# Altium schematic sheet Matrix.SchDoc
size A3; DrawnBy: JimBobJones; DocumentNumber: 2; SheetNumber: 2; SheetTotal: 4
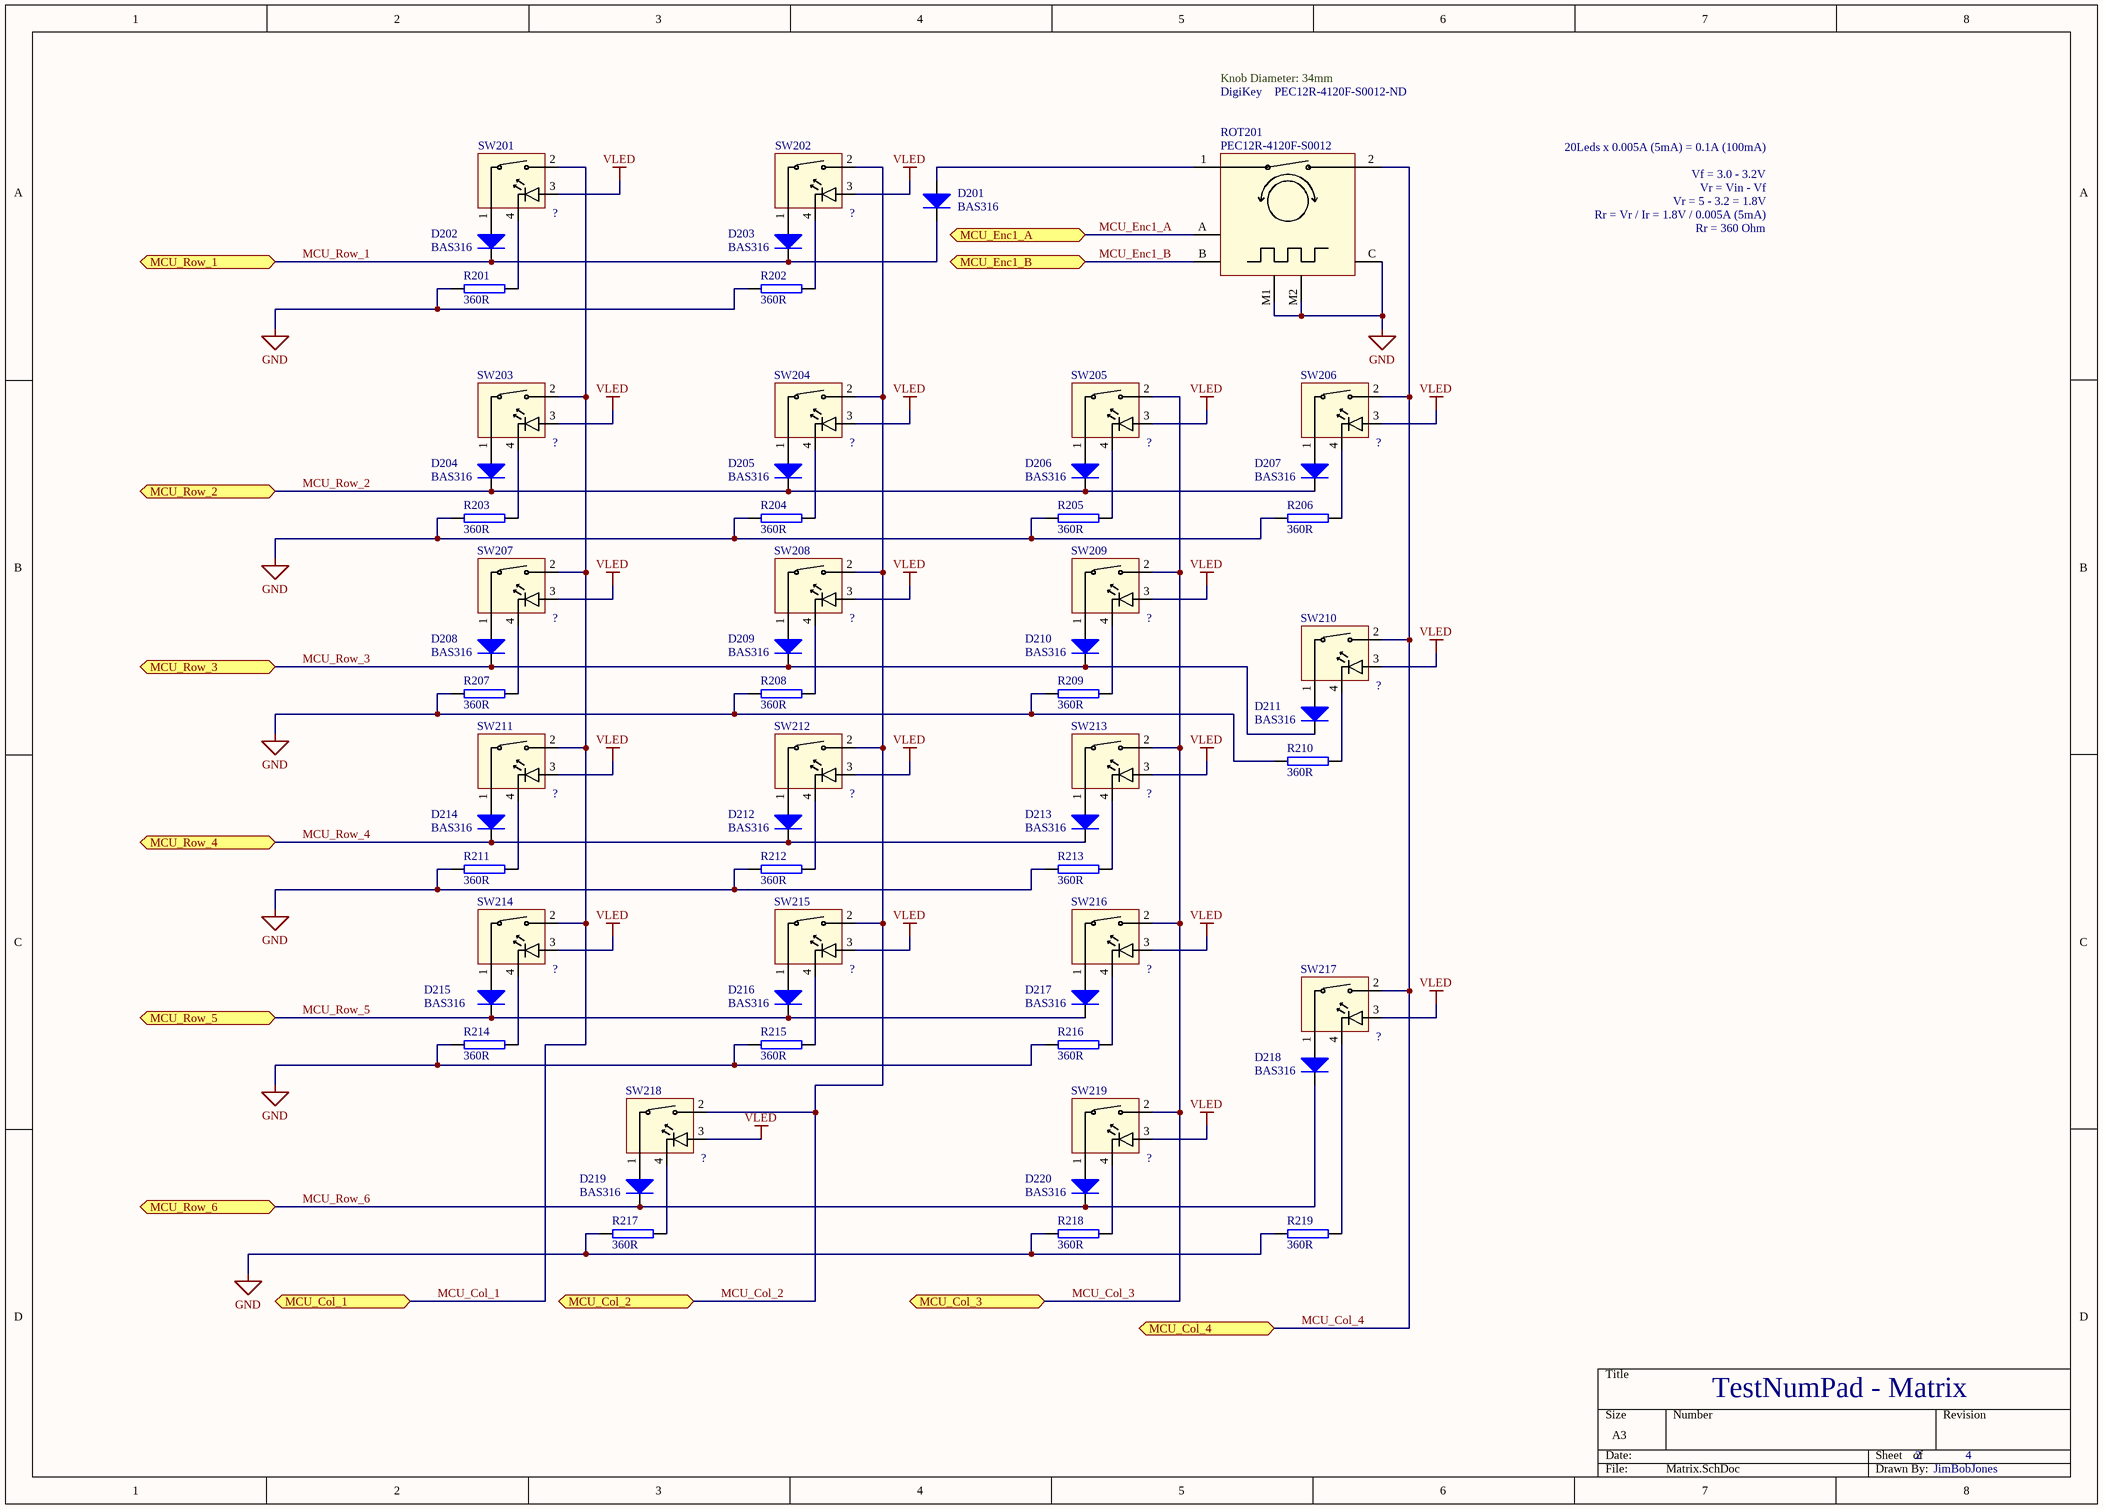
[diagram p0: Matrix.SchDoc]

## Parts
D201  BAS316  [SOD110/SOD323]
D202  BAS316  [SOD110/SOD323]
D203  BAS316  [SOD110/SOD323]
D204  BAS316  [SOD110/SOD323]
D205  BAS316  [SOD110/SOD323]
D206  BAS316  [SOD110/SOD323]
D207  BAS316  [SOD110/SOD323]
D208  BAS316  [SOD110/SOD323]
D209  BAS316  [SOD110/SOD323]
D210  BAS316  [SOD110/SOD323]
D211  BAS316  [SOD110/SOD323]
D212  BAS316  [SOD110/SOD323]
D213  BAS316  [SOD110/SOD323]
D214  BAS316  [SOD110/SOD323]
D215  BAS316  [SOD110/SOD323]
D216  BAS316  [SOD110/SOD323]
D217  BAS316  [SOD110/SOD323]
D218  BAS316  [SOD110/SOD323]
D219  BAS316  [SOD110/SOD323]
D220  BAS316  [SOD110/SOD323]
R201  360R  [2012R-360]
R202  360R  [2012R-360]
R203  360R  [2012R-360]
R204  360R  [2012R-360]
R205  360R  [2012R-360]
R206  360R  [2012R-360]
R207  360R  [2012R-360]
R208  360R  [2012R-360]
R209  360R  [2012R-360]
R210  360R  [2012R-360]
R211  360R  [2012R-360]
R212  360R  [2012R-360]
R213  360R  [2012R-360]
R214  360R  [2012R-360]
R215  360R  [2012R-360]
R216  360R  [2012R-360]
R217  360R  [2012R-360]
R218  360R  [2012R-360]
R219  360R  [2012R-360]
ROT201  PEC12R-4120F-S0012  Supplier Part Number 1: PEC12R-4120F-S0012-ND  [PEC12R-4xxxF-Sxxxx-NoMod]
SW201  MX_Apls  [MX-1U]  (value not drawn)
SW202  MX_Apls  [MX-1U]  (value not drawn)
SW203  MX_Apls  [MX-1U]  (value not drawn)
SW204  MX_Apls  [MX-1U]  (value not drawn)
SW205  MX_Apls  [MX-1U]  (value not drawn)
SW206  MX_Apls  [MX-1U]  (value not drawn)
SW207  MX_Apls  [MX-1U]  (value not drawn)
SW208  MX_Apls  [MX-1U]  (value not drawn)
SW209  MX_Apls  [MX-1U]  (value not drawn)
SW210  MX_Apls  [MX-2U]  (value not drawn)
SW211  MX_Apls  [MX-1U]  (value not drawn)
SW212  MX_Apls  [MX-1U]  (value not drawn)
SW213  MX_Apls  [MX-1U]  (value not drawn)
SW214  MX_Apls  [MX-1U]  (value not drawn)
SW215  MX_Apls  [MX-1U]  (value not drawn)
SW216  MX_Apls  [MX-1U]  (value not drawn)
SW217  MX_Apls  [MX-2U]  (value not drawn)
SW218  MX_Apls  [MX-2U]  (value not drawn)
SW219  MX_Apls  [MX-1U]  (value not drawn)

## Ports
MCU_Col_1 (bidir), MCU_Col_2 (bidir), MCU_Col_3 (bidir), MCU_Col_4 (bidir), MCU_Enc1_A (bidir), MCU_Enc1_B (bidir), MCU_Row_1 (bidir), MCU_Row_2 (bidir), MCU_Row_3 (bidir), MCU_Row_4 (bidir), MCU_Row_5 (bidir), MCU_Row_6 (bidir)

## Nets
GND: R201.2 R202.2 R203.1 R204.1 R205.1 R206.1 R207.1 R208.1 R209.1 R210.1 R211.1 R212.1 R213.1 R214.1 R215.1 R216.1 R217.1 R218.1 R219.1 ROT201.C ROT201.M1(M) ROT201.M2
VLED: SW201.3 SW202.3 SW203.3 SW204.3 SW205.3 SW206.3 SW207.3 SW208.3 SW209.3 SW210.3 SW211.3 SW212.3 SW213.3 SW214.3 SW215.3 SW216.3 SW217.3 SW218.3 SW219.3
MCU_Col_1: SW201.2 SW203.2 SW207.2 SW211.2 SW214.2 ; port MCU_Col_1
MCU_Col_2: SW202.2 SW204.2 SW208.2 SW212.2 SW215.2 SW218.2 ; port MCU_Col_2
MCU_Col_3: SW205.2 SW209.2 SW213.2 SW216.2 SW219.2 ; port MCU_Col_3
MCU_Col_4: ROT201.2 SW206.2 SW210.2 SW217.2 ; port MCU_Col_4
MCU_Enc1_A: ROT201.A ; port MCU_Enc1_A
MCU_Enc1_B: ROT201.B ; port MCU_Enc1_B
MCU_Row_1: D201.K(-) D202.K(-) D203.K(-) ; port MCU_Row_1
MCU_Row_2: D204.K(-) D205.K(-) D206.K(-) D207.K(-) ; port MCU_Row_2
MCU_Row_3: D208.K(-) D209.K(-) D210.K(-) D211.K(-) ; port MCU_Row_3
MCU_Row_4: D212.K(-) D213.K(-) D214.K(-) ; port MCU_Row_4
MCU_Row_5: D215.K(-) D216.K(-) D217.K(-) ; port MCU_Row_5
MCU_Row_6: D218.K(-) D219.K(-) D220.K(-) ; port MCU_Row_6
NetD201_A: D201.A(+) ROT201.1
NetD202_A: D202.A(+) SW201.1
NetD203_A: D203.A(+) SW202.1
NetD204_A: D204.A(+) SW203.1
NetD205_A: D205.A(+) SW204.1
NetD206_A: D206.A(+) SW205.1
NetD207_A: D207.A(+) SW206.1
NetD208_A: D208.A(+) SW207.1
NetD209_A: D209.A(+) SW208.1
NetD210_A: D210.A(+) SW209.1
NetD211_A: D211.A(+) SW210.1
NetD212_A: D212.A(+) SW212.1
NetD213_A: D213.A(+) SW213.1
NetD214_A: D214.A(+) SW211.1
NetD215_A: D215.A(+) SW214.1
NetD216_A: D216.A(+) SW215.1
NetD217_A: D217.A(+) SW216.1
NetD218_A: D218.A(+) SW217.1
NetD219_A: D219.A(+) SW218.1
NetD220_A: D220.A(+) SW219.1
NetR201_1: R201.1 SW201.4
NetR202_1: R202.1 SW202.4
NetR203_2: R203.2 SW203.4
NetR204_2: R204.2 SW204.4
NetR205_2: R205.2 SW205.4
NetR206_2: R206.2 SW206.4
NetR207_2: R207.2 SW207.4
NetR208_2: R208.2 SW208.4
NetR209_2: R209.2 SW209.4
NetR210_2: R210.2 SW210.4
NetR211_2: R211.2 SW211.4
NetR212_2: R212.2 SW212.4
NetR213_2: R213.2 SW213.4
NetR214_2: R214.2 SW214.4
NetR215_2: R215.2 SW215.4
NetR216_2: R216.2 SW216.4
NetR217_2: R217.2 SW218.4
NetR218_2: R218.2 SW219.4
NetR219_2: R219.2 SW217.4

## Notes on the sheet
- DigiKey
- Knob Diameter: 34mm
- Vf = 3.0 - 3.2V
- Vr = Vin - Vf
- 20Leds x 0.005A (5mA) = 0.1A (100mA)
- Vr = 5 - 3.2 = 1.8V
- Rr = Vr / Ir = 1.8V / 0.005A (5mA)
- Rr = 360 Ohm
- TestNumPad - Matrix

## Library data of the parts
D201-D220 = Diode-BAS316: Signal diode, 100V, 250mA, 400mW
R201-R219 = 2012R-360: RESISTOR 2012 1/4 WATT THIN FILM; Reel: *
ROT201 = PEC12R-Vert-Sw: Burns 6mm D-shaft 2-Ch Rotary Encoder with switch, 12ppr, Vertical; Supplier 1: Digi-Key
SW201-SW219 = MX-LED-1U: 1U - MX_Alps Hybrid Footprint; Key: ?